# Altium schematic sheet EEPROM.SchDoc
size A4; SheetNumber: 6; SheetTotal: 6
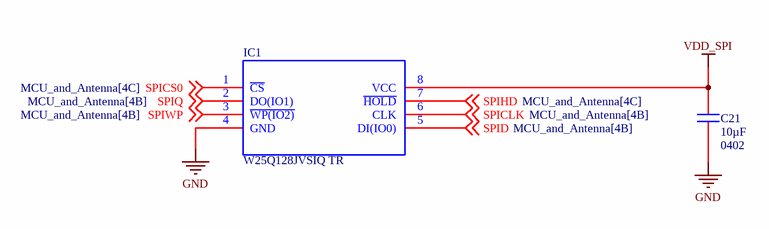
[diagram p0: EEPROM.SchDoc]

## Parts
C21  value 10µF  Case/Package: 0402  [CAPC1005X55N]  (hidden comment: GRM155R60J106ME15D)
IC1  W25Q128JVSIQ TR  [SOIC_208MIL_WIN-M]

## Nets
GND: C21.1 IC1.4(GND)
VDD_SPI: C21.2 IC1.8(VCC)
SPICLK: IC1.6(CLK) ; off-sheet SPICLK
SPICS0: IC1.1(~{CS}) ; off-sheet SPICS0
SPID: IC1.5(DI(IO0)) ; off-sheet SPID
SPIHD: IC1.7(~{HOLD}) ; off-sheet SPIHD
SPIQ: IC1.2(DO(IO1)) ; off-sheet SPIQ
SPIWP: IC1.3(~{WP(IO2)}) ; off-sheet SPIWP

## Library data of the parts
C21 = GRM155R60J106ME15D: 6.3V 10uF X5R ±20% 0402 Multilayer Ceramic Capacitors MLCC - SMD/SMT ROHS; Manufacturer: Murata; Manufacturer Lifecycle Status: IN PRODUCTION; Supplier: DigiKey; Supplier Part Number: 490-13238-6-ND; Manufacturer Part Number: GRM155R60J106ME15D; RoHS: Compliant; Category: Ceramic Capacitors; Stock: 101484; Pricing: 1=0,16, 10=0,088, 50=0,0618, 100=0,0538, 500=0,04036, 1000=0,03624, 2500=0,0319, 5000=0,02929 (USD); Case Code (Imperial): 0402; Case Code (Metric): 1005; Dielectric: X5R; Dielectric Material: Ceramic; Height: 500µm; Length: 1mm; Lifecycle Status: Production; Material: Ceramic; Max Operating Temperature: 85°C; Min Operating Temperature: -55°C; Mounting Technology: Surface Mount; Number of Terminals: 2; REACH SVHC: Yes; Schedule B: 8532240020, 8532240020|8532240020, 8532240020|8532240020|8532240020, 8532240020|8532240020|8532240020|8532240020; Thickness: 500µm; Tolerance: 20%; Voltage Rating: 6.3V; Voltage Rating (DC): 6.3V; Width: 500µm; ComponentLink1URL: https://datasheet.octopart.com:443/GRM155R60J106ME15D-Murata-datasheet-149522992.pdf?src-supplier=Newark; ComponentLink1Description: https://datasheet.octopart.com:443/GRM155R60J106ME15D-Murata-datasheet-149522992.pdf?src-supplier=Newark; ComponentLink2URL: https://datasheet.octopart.com:443/GRM155R60J106ME15D-Murata-datasheet-165579666.pdf?src-supplier=TME; ComponentLink2Description: https://datasheet.octopart.com:443/GRM155R60J106ME15D-Murata-datasheet-165579666.pdf?src-supplier=TME; ComponentLink3URL: https://datasheet.octopart.com:443/GRM155R60J106ME15D-Murata-datasheet-141266224.pdf?src-supplier=Ciiva; ComponentLink3Description: https://datasheet.octopart.com:443/GRM155R60J106ME15D-Murata-datasheet-141266224.pdf?src-supplier=Ciiva; ComponentLink4URL: https://datasheet.octopart.com:443/GRM155R60J106ME15D-Murata-datasheet-140689297.pdf?src-supplier=Ciiva; ComponentLink4Description: https://datasheet.octopart.com:443/GRM155R60J106ME15D-Murata-datasheet-140689297.pdf?src-supplier=Ciiva; ComponentLink5URL: https://datasheet.octopart.com:443/GRM155R60J106ME15D-Murata-datasheet-138740639.pdf?src-supplier=Ciiva; ComponentLink5Description: https://datasheet.octopart.com:443/GRM155R60J106ME15D-Murata-datasheet-138740639.pdf?src-supplier=Ciiva; ComponentLink6URL: https://datasheet.octopart.com:443/GRM155R60J106ME15D-Murata-datasheet-102370999.pdf?src-supplier=HQonline; ComponentLink6Description: https://datasheet.octopart.com:443/GRM155R60J106ME15D-Murata-datasheet-102370999.pdf?src-supplier=HQonline; ComponentLink7URL: https://datasheet.octopart.com/GRM155R60J106ME15D-Murata-datasheet-12515295.pdf; ComponentLink7Description: https://datasheet.octopart.com/GRM155R60J106ME15D-Murata-datasheet-12515295.pdf; ComponentLink8URL: https://datasheet.octopart.com/GRM155R60J106ME15D-Murata-datasheet-12510076.pdf; ComponentLink8Description: https://datasheet.octopart.com/GRM155R60J106ME15D-Murata-datasheet-12510076.pdf; ComponentLink9URL: https://datasheet.octopart.com/GRM155R60J106ME15D-Murata-datasheet-11978611.pdf; ComponentLink9Description: https://datasheet.octopart.com/GRM155R60J106ME15D-Murata-datasheet-11978611.pdf; ComponentLink10URL: https://datasheet.octopart.com/GRM155R60J106ME15D-Murata-datasheet-10025737.pdf; ComponentLink10Description: https://datasheet.octopart.com/GRM155R60J106ME15D-Murata-datasheet-10025737.pdf; ComponentLink11URL: https://datasheet.octopart.com/GRM155R60J106ME15D-Murata-datasheet-8819587.pdf; ComponentLink11Description: https://datasheet.octopart.com/GRM155R60J106ME15D-Murata-datasheet-8819587.pdf; ComponentLink12URL: http://sigma.octopart.com:80/reach_statement/Murata-company-16.pdf?src-supplier=Compliance+Statements; ComponentLink12Description: http://sigma.octopart.com:80/reach_statement/Murata-company-16.pdf?src-supplier=Compliance+Statements; LCSC Part: C412251
IC1 = W25Q128JVSIQ TR: NOR Flash Serial (SPI, Dual SPI, Quad SPI) 3V/3.3V 128M-bit 16M x 8 6ns 8-Pin SOIC T/R; Manufacturer: Winbond; Frequency: 104MHz; Interface: SPI, Serial; Memory Format: FLASH, NOR; Supplier: DigiKey; Supplier Part Number: 256-W25Q128JVSIQTRCT-ND; Manufacturer Part Number: W25Q128JVSIQ TR; RoHS: Compliant; Category: Flash; Stock: 40140; Pricing: 1=3,72, 10=3,468, 25=3,3672, 50=3,29, 100=3,2127, 250=3,11104, 500=3,03472, 1000=2,95921 (USD); Case/Package: SOIC; Max Operating Temperature: 85°C; Min Operating Temperature: -40°C; Schedule B: 8542320070, 8542320070|8542320070, 8542320070|8542320070|8542320070, 8542320070|8542320070|8542320070|8542320070; ComponentLink1URL: https://datasheet.octopart.com:443/W25Q128JVSIQ-TR-Winbond-datasheet-138104337.pdf?src-supplier=Augswan; ComponentLink1Description: https://datasheet.octopart.com:443/W25Q128JVSIQ-TR-Winbond-datasheet-138104337.pdf?src-supplier=Augswan; LCSC Part: C97521